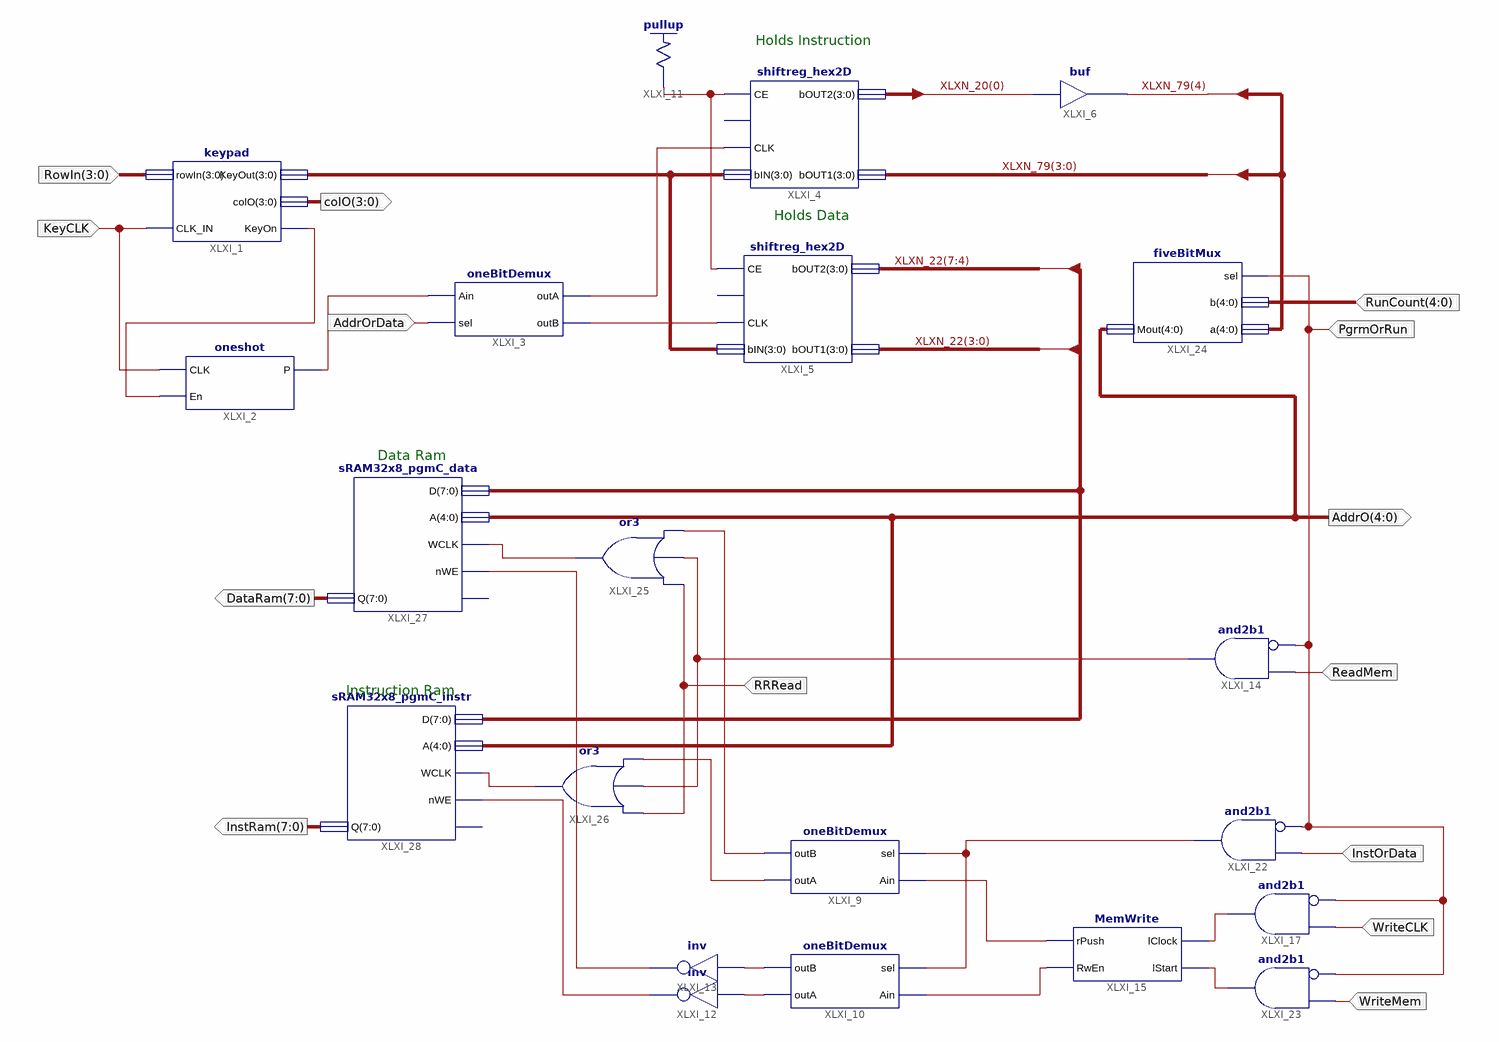
[diagram p0: schematic sheet 1]
// Xilinx ISE schematic GivenRamC.sch (spartan3e) as structural Verilog: 21 symbols, 14 ports
module GivenRamC (
  input  [3:0] RowIn,
  input  KeyCLK,
  input  AddrOrData,
  input  ReadMem,
  input  InstOrData,
  input  WriteCLK,
  input  WriteMem,
  input  RRRead,
  input  PgrmOrRun,
  input  [4:0] RunCount,
  output [3:0] colO,
  output [7:0] DataRam,
  output [7:0] InstRam,
  output [4:0] AddrO
);

  wire khiv, XLXN_6, XLXN_8, XLXN_18, XLXN_19, XLXN_21, XLXN_25, XLXN_27, XLXN_46, XLXN_47, XLXN_48, XLXN_68,
       XLXN_78, XLXN_80, XLXN_81, XLXN_82, XLXN_83, XLXN_84, XLXN_85;
  wire [3:0] XLXN_9, XLXN_20;
  wire [4:0] XLXN_79;
  wire [7:0] XLXN_22;

  keypad XLXI_1 (.rowIn(RowIn), .CLK_IN(KeyCLK), .KeyOut(XLXN_9), .colO(colO), .KeyOn(XLXN_25));
  oneshot XLXI_2 (.CLK(KeyCLK), .En(XLXN_25), .P(XLXN_6));
  oneBitDemux XLXI_3 (.Ain(XLXN_6), .sel(AddrOrData), .outA(XLXN_18), .outB(XLXN_8));
  shiftreg_hex2D XLXI_4 (
    .CE(XLXN_19), .CLK(XLXN_18), .bIN(XLXN_9), .bOUT2(XLXN_20), .bOUT1(XLXN_79[3:0]));  // open: RST
  shiftreg_hex2D XLXI_5 (
    .CE(XLXN_19), .CLK(XLXN_8), .bIN(XLXN_9), .bOUT2(XLXN_22[7:4]), .bOUT1(XLXN_22[3:0]));  // open: RST
  buf XLXI_6 (XLXN_79[4], XLXN_20[0]);
  oneBitDemux XLXI_9 (.Ain(XLXN_48), .sel(khiv), .outA(XLXN_83), .outB(XLXN_82));
  oneBitDemux XLXI_10 (.Ain(XLXN_27), .sel(khiv), .outA(XLXN_21), .outB(XLXN_85));
  \pullup  XLXI_11 (.O(XLXN_19));
  not XLXI_12 (XLXN_46, XLXN_21);
  not XLXI_13 (XLXN_47, XLXN_85);
  and XLXI_14 (XLXN_84, ~PgrmOrRun, ReadMem);  // and2b1
  MemWrite XLXI_15 (.lStart(XLXN_78), .lClock(XLXN_68), .RwEn(XLXN_27), .rPush(XLXN_48));
  and XLXI_22 (khiv, ~PgrmOrRun, InstOrData);  // and2b1
  and XLXI_17 (XLXN_68, ~PgrmOrRun, WriteCLK);  // and2b1
  and XLXI_23 (XLXN_78, ~PgrmOrRun, WriteMem);  // and2b1
  or XLXI_26 (XLXN_81, XLXN_83, XLXN_84, RRRead);
  or XLXI_25 (XLXN_80, XLXN_82, XLXN_84, RRRead);
  fiveBitMux XLXI_24 (.a(XLXN_79), .b(RunCount), .sel(PgrmOrRun), .Mout(AddrO));
  sRAM32x8_pgmC_data XLXI_27 (.nWE(XLXN_47), .WCLK(XLXN_80), .A(AddrO), .D(XLXN_22), .Q(DataRam));  // open: nCS
  sRAM32x8_pgmC_instr XLXI_28 (.nWE(XLXN_46), .WCLK(XLXN_81), .A(AddrO), .D(XLXN_22), .Q(InstRam));  // open: nCS

  // Notes on the sheet:
  //   Holds Instruction
  //   Holds Data
  //   Data Ram
  //   Instruction Ram
endmodule
